# Altium schematic sheet PSU_MGTAVCC_Buck.SchDoc
size A3; SheetNumber: 9; SheetTotal: 32
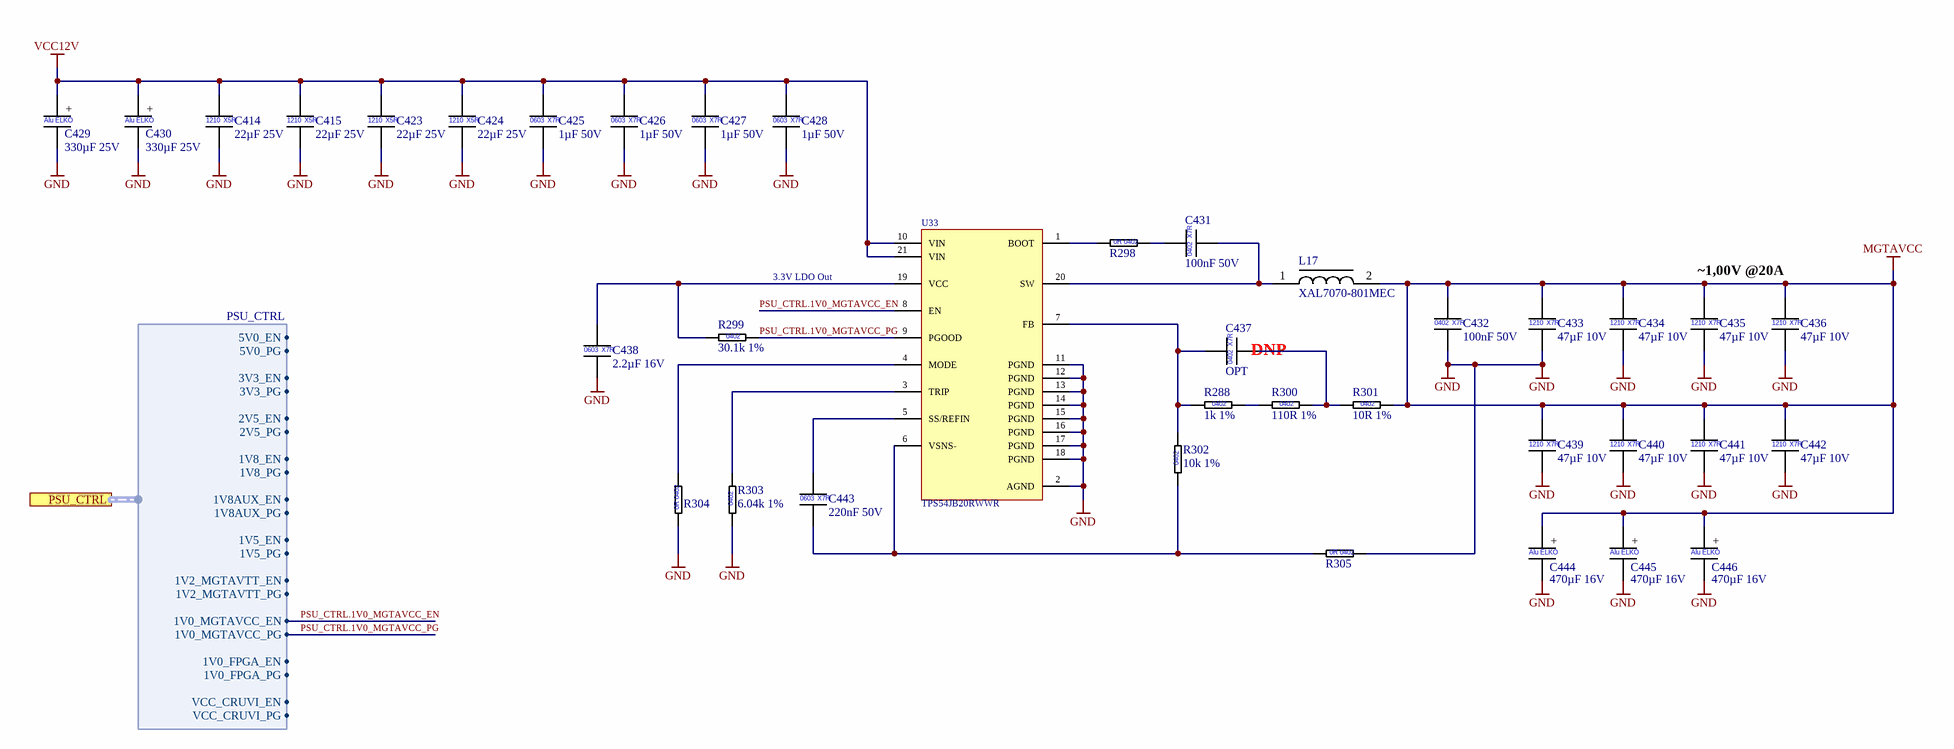
[diagram p0: PSU_MGTAVCC_Buck.SchDoc]

## Parts
C414  22µF 25V  [CAP_1210]
C415  22µF 25V  [CAP_1210]
C423  22µF 25V  [CAP_1210]
C424  22µF 25V  [CAP_1210]
C425  1µF 50V  [CAP_0603]
C426  1µF 50V  [CAP_0603]
C427  1µF 50V  [CAP_0603]
C428  1µF 50V  [CAP_0603]
C429  330µF 25V  [WCAP-PTG5_D10H12.5]
C430  330µF 25V  [WCAP-PTG5_D10H12.5]
C431  100nF 50V  [CAP_0402]
C432  100nF 50V  [CAP_0402]
C433  47µF 10V  [CAP_1210]
C434  47µF 10V  [CAP_1210]
C435  47µF 10V  [CAP_1210]
C436  47µF 10V  [CAP_1210]
C437  OPT  [CAP_0402]  (no BOM)
C438  2.2µF 16V  [CAP_0603]
C439  47µF 10V  [CAP_1210]
C440  47µF 10V  [CAP_1210]
C441  47µF 10V  [CAP_1210]
C442  47µF 10V  [CAP_1210]
C443  220nF 50V  [CAP_0603]
C444  470µF 16V  [WCAP-PTG5_D8H13]
C445  470µF 16V  [WCAP-PTG5_D8H13]
C446  470µF 16V  [WCAP-PTG5_D8H13]
L17  XAL7070-801MEC  [COILCRAFT_XAL7070]
R288  1k 1%  [RES_0402]
R298  0R Jumper  [RES_0402]  (value not drawn)
R299  30.1k 1%  [RES_0402]
R300  110R 1%  [RES_0402]
R301  10R 1%  [RES_0402]
R302  10k 1%  [RES_0402]
R303  6.04k 1%  [RES_0402]
R304  0R Jumper  [RES_0402]  (value not drawn)
R305  0R Jumper  [RES_0402]  (value not drawn)
U33  TPS54JB20RWWR  [VQFN-HR21_RWW0021A]

## Ports
PSU_CTRL (harness PSU_CTRL, see Power-Tree[2B], PSU_MGTAVTT_Buck[1B], PSU_VCC1V0_FPGA_Buck[1B], PSU_VCC1V5_Buck[1B], PSU_VCC1V8_Buck[1B], PSU_VCC1V8AUX_Buck[1B], PSU_VCC2V5_Buck[1B], PSU_VCC3V3_Buck[1B], PSU_VCC5V_Buck[1B], PSU_VCC_CRUVI_ADJ_Buck[1B])

## Harnesses
PSU_CTRL: 5V0_EN, 5V0_PG, 3V3_EN, 3V3_PG, 2V5_EN, 2V5_PG, 1V8_EN, 1V8_PG, 1V8AUX_EN, 1V8AUX_PG, 1V5_EN, 1V5_PG, 1V2_MGTAVTT_EN, 1V2_MGTAVTT_PG, 1V0_MGTAVCC_EN, 1V0_MGTAVCC_PG, 1V0_FPGA_EN, 1V0_FPGA_PG, VCC_CRUVI_EN, VCC_CRUVI_PG

## Nets
GND: C414.2 C415.2 C423.2 C424.2 C425.2 C426.2 C427.2 C428.2 C429.2 C430.2 C432.2 C433.2 C434.2 C435.2 C436.2 C438.2 C439.2 C440.2 C441.2 C442.2 C444.2 C445.2 C446.2 R303.1 R304.1 R305.2 U33.2(AGND) U33.11(PGND) U33.12(PGND) U33.13(PGND) U33.14(PGND) U33.15(PGND) U33.16(PGND) U33.17(PGND) U33.18(PGND)
MGTAVCC: C432.1 C433.1 C434.1 C435.1 C436.1 C439.1 C440.1 C441.1 C442.1 C444.1 C445.1 C446.1 L17.2 R301.2
VCC12V: C414.1 C415.1 C423.1 C424.1 C425.1 C426.1 C427.1 C428.1 C429.1 C430.1 U33.10(VIN) U33.21(VIN)
PSU_CTRL.1V0_MGTAVCC_EN: U33.8(EN) ; port PSU_CTRL.1V0_MGTAVCC_EN
PSU_CTRL.1V0_MGTAVCC_PG: R299.2 U33.9(PGOOD) ; port PSU_CTRL.1V0_MGTAVCC_PG
NetC431_1: C431.1 R298.2
NetC431_2: C431.2 L17.1 U33.20(SW)
NetC437_1: C437.1 R288.1 R302.2 U33.7(FB)
NetC437_2: C437.2 R300.2 R301.1
NetC438_1: C438.1 R299.1 U33.19(VCC)
NetC443_1: C443.1 U33.5(SS/REFIN)
NetC443_2: C443.2 R302.1 R305.1 U33.6(VSNS-)
NetR288_2: R288.2 R300.1
NetR298_1: R298.1 U33.1(BOOT)
NetR303_2: R303.2 U33.3(TRIP)
NetR304_2: R304.2 U33.4(MODE)

## Notes on the sheet
- 3.3V LDO Out
- (near C436) ~1,00V @20A
- (near C437) DNP
- Company:
- Contact:
- Customer:
- mail@pcb-arts.com
- PCB Arts GmbH
- Title:
- Project:
- The  information  contained  in  these  documents  is  confidential,  privileged  and  only  for  the information of the intended recipient and may not be used, published or redistributed Without the prior written consent from PCB Arts GmbH.
- Engineer:
- Document Number:
- Revision:
- Variant:
- Date:
- Time:
- Sheet:
- Status:
- /
- (in symbol CAP_0402_100nF_50V) X7R; 0402
- (in symbol CAP_0402_OPT) X7R; 0402
- (in symbol CAP_0603_1µF_50V_X7R_10%) 0603; X7R
- (in symbol CAP_0603_2.2µF_16V_X7R_10%) 0603; X7R
- (in symbol CAP_0603_220nF_50V_X7R_10%) 0603; X7R
- (in symbol CAP_1210_22µF_25V) 1210; X5R
- (in symbol CAP_1210_47µF_10V_X7R_10%) 1210; X7R
- (in symbol CAP_D8L9_470µF_16V) +; Alu ELKO
- (in symbol CAP_D10L12.5_330µF_25V) +; Alu ELKO
- (in symbol RES_0402_0R Jumper) 0R 0402
- (in symbol RES_0402_1k_1%) 0402
- (in symbol RES_0402_6.04k_1%) 0402
- (in symbol RES_0402_10k_1%) 0402
- (in symbol RES_0402_10R_1%) 0402
- (in symbol RES_0402_30.1k_1%) 0402
- (in symbol RES_0402_110R_1%) 0402

## Library data of the parts
C414 C415 C423 C424 = CAP_1210_22µF_25V: Multilayer Ceramic Capacitors MLCC - SMD/SMT 1210 25VDC; Manufacturer 1: KEMET; Manufacturer 1 Prt. Nr.: C1210C226K3PACTU; Manufacturer 2 Prt. Nr.: TMK212BBJ226MG-TT; Manufacturer 2: Taiyo Yuden
C425-C428 = CAP_0603_1µF_50V_X7R_10%: Multilayer Ceramic Capacitors MLCC - SMD/SMT 50V 1uF X7R 0603 10%; Manufacturer 1: KYOCERA AVX; Manufacturer 1 Prt. Nr.: 06035C105KAT2A; Manufacturer 2 Prt. Nr.: MSASU168AB7105KTNA01; Manufacturer 2: TAIYO YUDEN
C429 C430 = CAP_D10L12.5_330µF_25V: Organische Polymer-Aluminiumkondensatoren 330uF 25 Volts 20% AEC-Q200; Manufacturer 1: Würth Elektronik; Manufacturer 1 Prt. Nr.: 870025575009
C431 C432 = CAP_0402_100nF_50V: Multilayer Ceramic Capacitors MLCC - SMD/SMT 0402 50VDC; Manufacturer 1: Murata Electronics; Manufacturer 1 Prt. Nr.: GCM155L8EH104KE07D; Manufacturer 2 Prt. Nr.: UMK105B7104KV-FR; Manufacturer 2: TDK
C433-C436 C439-C442 = CAP_1210_47µF_10V_X7R_10%: Multilayer Ceramic Capacitors MLCC - SMD/SMT 47 uF 10 VDC 10% 1210 X7R; Manufacturer 1: Murata Electronics; Manufacturer 1 Prt. Nr.: GRM32ER71A476KE15L; Manufacturer 2 Prt. Nr.: C1210C106K8RACTU; Manufacturer 2: KEMET
C437 = CAP_0402_OPT: Multilayer Ceramic Capacitors MLCC - SMD/SMT 0402 Optional Placeholder
C438 = CAP_0603_2.2µF_16V_X7R_10%: Multilayer Ceramic Capacitors MLCC - SMD/SMT 2.2 uF 16 VDC 10% 0603 X7R; Manufacturer 1: Murata Electronics; Manufacturer 1 Prt. Nr.: GRM188Z71C225KE43D; Manufacturer 2 Prt. Nr.: EMK107BB7225KA-T; Manufacturer 2: TAIYO YUDEN
C443 = CAP_0603_220nF_50V_X7R_10%: Multilayer Ceramic Capacitors MLCC - SMD/SMT 0.22 uF 50 VDC 10% 0603 X7R; Manufacturer 1: Murata Electronics; Manufacturer 1 Prt. Nr.: GRJ188R71H224KE11D; Manufacturer 2 Prt. Nr.: CGA3E3X7R1H224K080AE; Manufacturer 2: TDK
C444-C446 = CAP_D8L9_470µF_16V: Organische Polymer-Aluminiumkondensatoren 470uF 16 Volts 20%; Manufacturer 1: Würth Elektronik; Manufacturer 1 Prt. Nr.: 870025374007
L17 = XAL7070-801MEC_Power Inductors SMD 800nH Shld 20% 25.8A 2.29mOhms AECQ200: Power Inductors - SMD 800nH Shld 20% 25.8A 2.29mOhms AECQ200; Manufacturer 1: Coilcraft; Manufacturer 1 Prt. Nr.: XAL7070-801MEC
R288 = RES_0402_1k_1%: Thick Film Resistors - SMD 1kOhm 1%; Manufacturer 1: Vishay / Dale; Manufacturer 1 Prt. Nr.: CRCW04021K00FKEDC; Manufacturer 2 Prt. Nr.: RC0402FR-7W1KL; Manufacturer 2: Yageo
R298 R304 R305 = RES_0402_0R Jumper: Thick Film Resistors - SMD 0Ohm; Manufacturer 1: Vishay / Dale; Manufacturer 1 Prt. Nr.: CRCW04020000Z0EDC; Manufacturer 2 Prt. Nr.: RC0402JR-070RL; Manufacturer 2: Yageo
R299 = RES_0402_30.1k_1%: Thick Film Resistors - SMD 30.1kOhm 1%; Manufacturer 1: Vishay / Dale; Manufacturer 1 Prt. Nr.: CRCW040230K1FKEDC; Manufacturer 2 Prt. Nr.: RC0402FR-1330K1L; Manufacturer 2: Yageo
R300 = RES_0402_110R_1%: Thick Film Resistors - SMD 110Ohm 1%; Manufacturer 1: Vishay / Dale; Manufacturer 1 Prt. Nr.: CRCW0402110RFKTD; Manufacturer 2 Prt. Nr.: RC0402FR-7W110RL; Manufacturer 2: Yageo
R301 = RES_0402_10R_1%: Thick Film Resistors - SMD 10Ohm 1%; Manufacturer 1: Vishay / Dale; Manufacturer 1 Prt. Nr.: CRCW040210R0FKEE; Manufacturer 2 Prt. Nr.: RC0402FR-7W10RL; Manufacturer 2: Yageo
R302 = RES_0402_10k_1%: Thick Film Resistors - SMD 10kOhm 1%; Manufacturer 1: Vishay / Dale; Manufacturer 1 Prt. Nr.: CRCW040210K0FKEDC; Manufacturer 2 Prt. Nr.: RC0402FR-7W10KL; Manufacturer 2: Yageo
R303 = RES_0402_6.04k_1%: Thick Film Resistors - SMD 6.04kOhm 1%; Manufacturer 1: Vishay / Dale; Manufacturer 1 Prt. Nr.: CRCW04026K04FKEDC; Manufacturer 2 Prt. Nr.: RC0402FR-7W6K04L; Manufacturer 2: Yageo
U33 = TPS54JB20RWWR_Switching Voltage Regulators 2.7-V to 16-V input 20-A synchronous Buck: Switching Voltage Regulators 2.7-V to 16-V input 20-A synchronous Buck; Manufacturer 1: Texas Instruments; Manufacturer 1 Prt. Nr.: TPS54JB20RWWR